# Altium schematic sheet Photogate.SchDoc: Custom Photogate
size A4; DocumentNumber: 1; Revision: 0; SheetNumber: 1; SheetTotal: 4
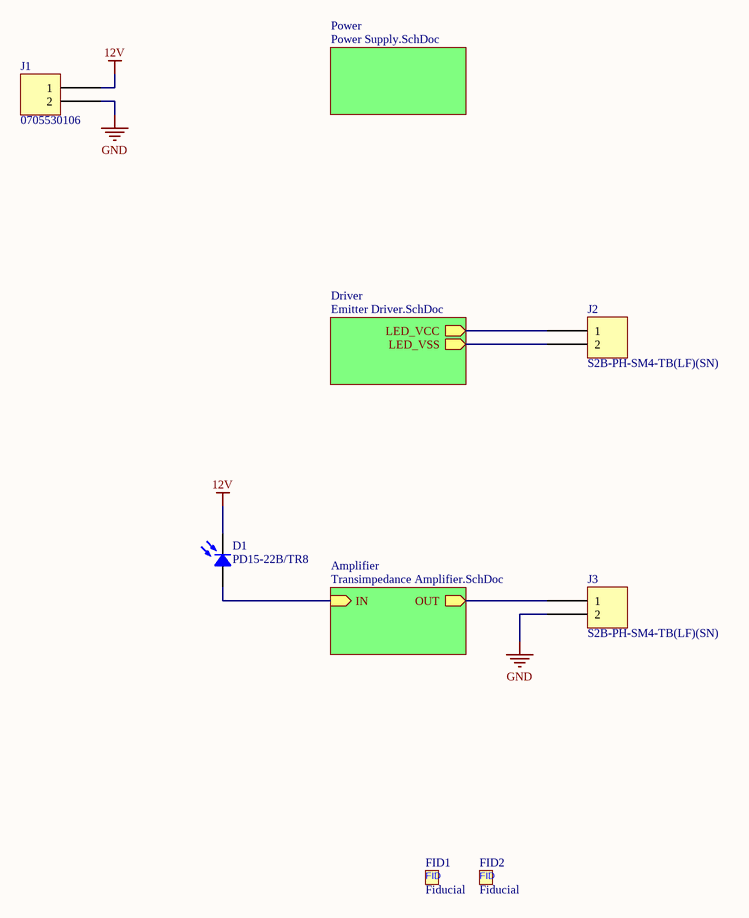
[diagram p0: Photogate.SchDoc]

## Parts
D1  PD15-22B/TR8  [Everlight PD15-22]
FID1  Fiducial  [Fiducial]  (no BOM)
FID2  Fiducial  [Fiducial]  (no BOM)
J1  0705530106  [MOLEX SDA-70553-2PIN]
J2  S2B-PH-SM4-TB(LF)(SN)  [JST S2B-PH-SM4-TB]
J3  S2B-PH-SM4-TB(LF)(SN)  [JST S2B-PH-SM4-TB]

## Sub-sheets
Amplifier = Transimpedance Amplifier.SchDoc: IN (in), OUT (out)
Driver = Emitter Driver.SchDoc: LED_VCC (out), LED_VSS (out)
Power = Power Supply.SchDoc: no entries

## Nets
12V: D1.2 J1.1
GND: J1.2 J3.2
NetD1_1: D1.1 ; sheet Amplifier/IN
NetJ2_1: J2.1 ; sheet Driver/LED_VCC
NetJ2_2: J2.2 ; sheet Driver/LED_VSS
NetJ3_1: J3.1 ; sheet Amplifier/OUT

## Notes on the sheet
- Title
- Size:
- Date:
- A4
- Number:
- Time:
- Revision:
- Sheet
- of
- File:
- (in symbol Fiducial) FID

## Library data of the parts
D1 = PD15-22B/TR8: SENSOR PHOTODIODE 940NM 4SMD; Manufacturer: Everlight Electronics Co Ltd; Current - Dark (Typ): 10nA; Diode Type: PIN; Response Time: 10ns; Spectral Range: 730nm ~ 1100nm; Voltage - DC Reverse (Vr) (Max): 32V; Part Number: PD15-22B/TR8; ComponentLink1Description: Datasheet; ComponentLink1URL: //media.digikey.com/pdf/Data%20Sheets/Everlight%20PDFs/PD15-22B_TR8.pdf; ComponentLink2Description: DigiKey Link; ComponentLink2URL: //digikey.com/product-detail/en/everlight-electronics-co-ltd/PD15-22B-TR8/1080-1366-2-ND/2675857; Device Package: 4-SMD, No Lead; LastUpdated: 09/12/2019 02:27:51; Lifecycle Status: 0; Minimum Order: 1; Mounting Type: Surface Mount; Operating Temperature: -40°C ~ 85°C; Package / Case: 4-SMD, No Lead; Packaging: TapeAndReel; Part Status: Active; Price: 0.13; Series: -; Supplier 1: DigiKey; Supplier Part Number 1: 1080-1366-2-ND; Wavelength: 940nm
J1 = 0705530106: CONN HEADER R/A 2POS 2.54MM; Manufacturer: Molex; Contact Length - Mating: 0.240" (6.10mm); Contact Length - Post: 0.130" (3.30mm); Material Flammability Rating: UL94 V-0; Number of Positions: 2; Number of Positions Loaded: All; Pitch - Mating: 0.100" (2.54mm); Shrouding: Shrouded - 4 Wall; Style: Board to Cable/Wire; Voltage Rating: 250V; Part Number: 0705530106; ComponentLink1Description: Datasheet; ComponentLink1URL: https://www.molex.com/pdm_docs/sd/705530106_sd.pdf; ComponentLink2Description: DigiKey Link; ComponentLink2URL: http://digikey.com/product-detail/en/molex/0705530106/WM4153-ND/1643386; Connector Type: Header; Contact Finish - Mating: Gold; Contact Finish - Post: Tin; Contact Finish Thickness - Mating: 30.0µin (0.76µm); Contact Material: Phosphor Bronze; Contact Shape: Square; Contact Type: Male Pin; Fastening Type: Latch Holder; Insulation Color: Black; Insulation Height: 0.215" (5.45mm); Insulation Material: Polyester, Glass Filled; LastUpdated: 12/01/2020 23:55:40; Lifecycle Status: Active; Minimum Order: 1; Mounting Type: Through Hole, Right Angle; Number of Rows: 1; Operating Temperature: -40°C ~ 105°C; Packaging: Tube; PartId: 85; Part Status: Active; Price: 1.38; Series: SL 70553; Supplier 1: DigiKey; Supplier Part Number 1: WM4153-ND; Termination: Solder
J2 J3 = S2B-PH-SM4-TB(LF)(SN): CONN HEADER SMD R/A 2POS 2MM; Manufacturer: JST Sales America Inc.; Contact Length - Mating: 0.130" (3.30mm); Current Rating (Amps): 2A; Material Flammability Rating: UL94 V-0; Number of Positions: 2; Number of Positions Loaded: All; Pitch - Mating: 0.079" (2.00mm); Shrouding: Shrouded - 4 Wall; Style: Board to Cable/Wire; Voltage Rating: 100V; Part Number: S2B-PH-SM4-TB(LF)(SN); ComponentLink1Description: Datasheet; ComponentLink1URL: http://www.jst-mfg.com/product/pdf/eng/ePH.pdf; ComponentLink2Description: DigiKey Link; ComponentLink2URL: http://digikey.com/product-detail/en/jst-sales-america-inc/S2B-PH-SM4-TB-LF-SN/455-1749-1-ND/926846; Connector Type: Header; Contact Finish - Mating: Tin; Contact Finish - Post: Tin; Contact Material: Copper Alloy; Contact Shape: Square; Contact Type: Male Pin; Fastening Type: Detent Lock; Features: Solder Retention; Insulation Color: Natural; Insulation Height: 0.217" (5.51mm); Insulation Material: Polyamide (PA6T), Nylon 6T; LastUpdated: 15/01/2020 03:45:11; Lifecycle Status: Active; Minimum Order: 1; Mounting Type: Surface Mount, Right Angle; Number of Rows: 1; Operating Temperature: -25°C ~ 85°C; Packaging: TapeAndReel; PartId: 115; Part Status: Active; Price: 0.27; Series: PH; Supplier 1: DigiKey; Supplier Part Number 1: 455-1749-1-ND; Termination: Solder